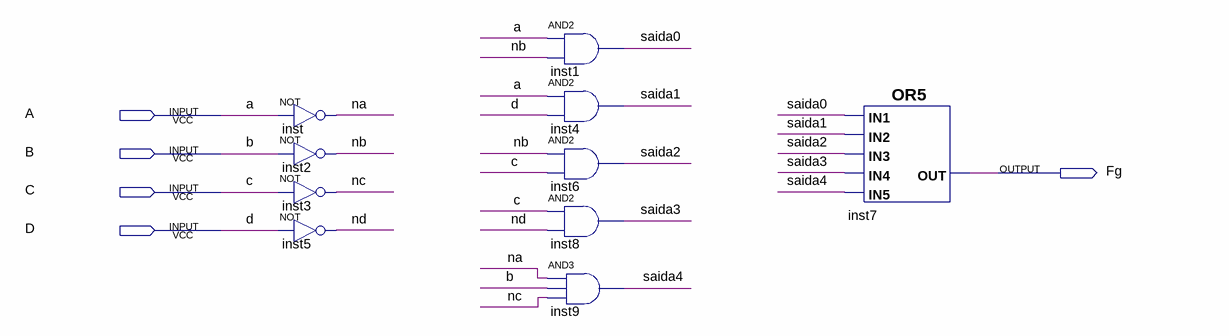
[diagram p0: schematic sheet]
// Quartus schematic FuncaoG.bdf as structural Verilog: 10 symbols, 5 pins
module FuncaoG (
  input  A,
  input  B,
  input  C,
  input  D,
  output Fg
);

  wire na, nb, nc, nd, saida0, saida1, saida2, saida3, saida4;

  not inst (na, A);
  not inst2 (nb, B);
  not inst3 (nc, C);
  not inst5 (nd, D);
  and inst1 (saida0, A, nb);
  and inst4 (saida1, A, D);
  and inst6 (saida2, nb, C);
  and inst8 (saida3, C, nd);
  and inst9 (saida4, na, B, nc);
  or inst7 (Fg, saida0, saida1, saida2, saida3, saida4);
endmodule
